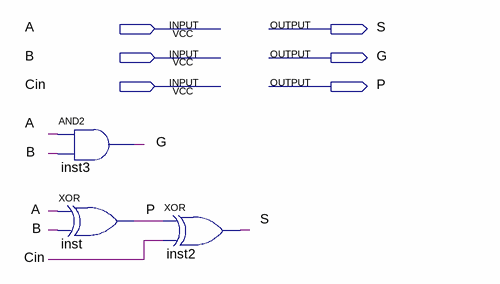
[diagram p0: schematic sheet]
// Quartus schematic FAPG.bdf as structural Verilog: 3 symbols, 6 pins
module FAPG (
  input  A,
  input  B,
  input  Cin,
  output S,
  output G,
  output P
);

  and inst3 (G, A, B);
  xor inst (P, A, B);
  xor inst2 (S, P, Cin);
endmodule
